# EAGLE design X10_PowerBoard_RevB (EAGLE 9.6.2)
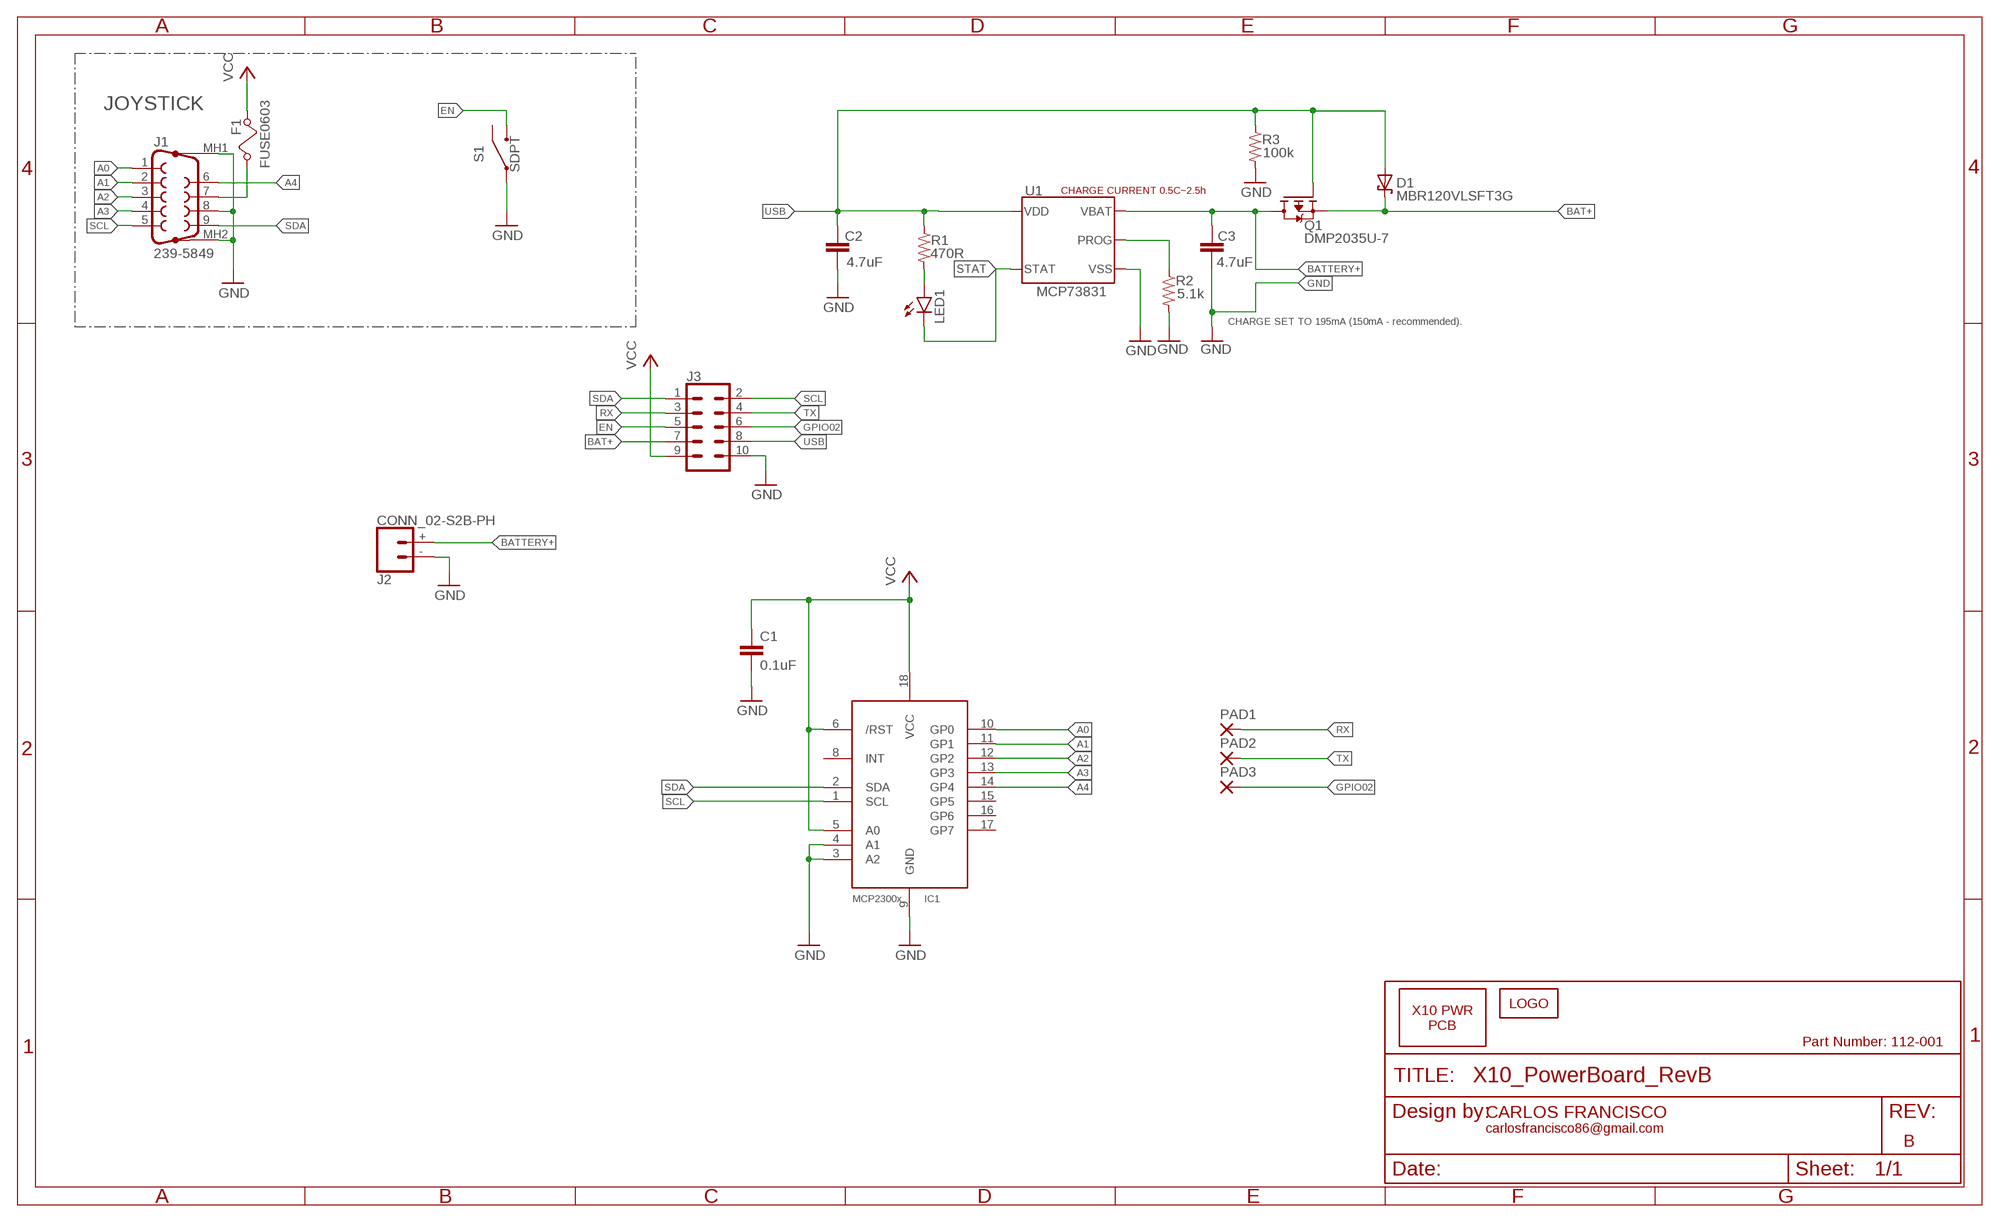
[diagram p0: schematic, sheet 1]

## Parts
C1  0.1uF  C-EUC0603  [C0603]
C2  4.7uF  C-4.7UF-10V-X5R-0603  [CAPC1608X85]
C3  4.7uF  C-4.7UF-10V-X5R-0603  [CAPC1608X85]
D1  MBR120VLSFT3G  DIODE-SCHOTTKY-20V-1ASOD-123FL  [SODFL3616X98N]
F1  FUSE0603  [FUSC1607X75N]
IC1  MCP23008/P  [DIL18]
J1  239-5849  DB9_MALE-SLOTS  [DB9_PLUG_SLOT]
J2  CONN_02-S2B-PH  [S2B-PH-RA]
J3  CONN2_05-HEADER  [2X5_HEADER]
LED1  LEDSML0603  [SML0603]
LOGO1  LOGO-10MM  [LOGO_10MM]
PAD1  1,6/0,8  [1,6/0,8]
PAD2  1,6/0,8  [1,6/0,8]
PAD3  1,6/0,8  [1,6/0,8]
PCB1  X10_PWR_PCB-X10_PWR_PCB  [X10_POWER_PCB]
Q1  DMP2035U-7  P-MOSFET-DMP2035U-7-SOT323  [SOT95P230X110-3N]
R1  470R  R-BACKUP-470R-1%-0603  [RESC1608X60]
R2  5.1k  R-5.1K-1%-0603  [RESC1608X60]
R3  100k  R-100K-1%-0603  [RESC1608X60]
S1  SDPT  SLIDE_SWITCH  [OS102011MA1QN1]
U1  MCP73831  [SOT23-5P95_270X145L35X35N]

## Nets
A0: IC1.10(GP0) J1.1
A1: IC1.11(GP1) J1.2
A2: IC1.12(GP2) J1.3
A3: IC1.13(GP3) J1.4
A4: IC1.14(GP4) J1.6
BAT+: D1.K(C) J3.7 Q1.2(S)
BATTERY+: C3.1 J2.+ Q1.3(D) U1.3(VBAT)
EN: J3.5 S1.1
GND: C1.2 C2.2 C3.2 IC1.3(A2) IC1.4(A1) IC1.9(GND) J1.8 J1.MH1(G1) J1.MH2(G2) J2.- J3.10 R2.1 R3.1 S1.2 U1.2(VSS)
GPIO02: J3.6 PAD3.1(P)
N$1: LED1.A R1.1
N$2: F1.1 J1.7
N$6: R2.2 U1.5(PROG)
RX: J3.3 PAD1.1(P)
SCL: IC1.1(SCL) J1.5 J3.2
SDA: IC1.2(SDA) J1.9 J3.1
STAT: LED1.C U1.1(STAT)
TX: J3.4 PAD2.1(P)
USB: C2.1 D1.A J3.8 Q1.1(G) R1.2 R3.2 U1.4(VDD)
VCC: C1.1 F1.2 IC1.5(A0) IC1.6(/RST) IC1.18(VCC) J3.9
Unconnected: IC1.8(INT) IC1.15(GP5) IC1.16(GP6) IC1.17(GP7) S1.3

## Notes on the sheet
- JOYSTICK
- CHARGE CURRENT 0.5C~2.5h
- CHARGE SET TO 195mA (150mA - recommended).
- Part Number: 112-001
- CARLOS FRANCISCO
- carlosfrancisco86@gmail.com
- B

## Library data of the parts
C1 = rcl:C-EU: CAPACITOR, European symbol; SPICEPREFIX: C
C2 C3 = PacificNovelty:C; DESCRIPTION: CAP CER 4.7UF 10V X5R 0603; MFR: Samsung Electro-Mechanics; MFR_NUM: CL10A475KP8NNNC; OC_FARNELL: unknown; VENDOR: Digi-Key; VENDOR_NUM: 1276-1044-1-ND
D1 = PacificNovelty:DIODE-SCHOTTKY: Schottky Diode; DESCRIPTION: Semiconductor DIODE SCHOTTKY 20V 1A SOD123FL; MFR: On Semiconductor; MFR_NUM: MBR120VLSFT3G; VENDOR: Digi-Key; VENDOR_NUM: MBR120VLSFT3GOSCT-ND
F1 = ACINLibrary:FUSE
IC1 = AceCenter:MCP23008: MCP23008 Inexpensive i2c i/o expander - 8 general purpose i/o pins with optional pullups
J1 = AceCenter:DB9_MALE: D-SUB Connector - Right Angle; DESCRIPTION: D-sub Connector - 2.77mm Pitch; MFR: RS Pro; MFR_NUM: 239-5849; VENDOR: RS-Online; VENDOR_NUM: 239-5849
J2 = AceCenter:CONN_02
J3 = AceCenter:CONN2_05
LED1 = led:LED: LED OSRAM: - CHIPLED LG R971, LG N971, LY N971, LG Q971, LY Q971, LO R971, LY R971 LH N974, LH R974 LS Q976, LO Q976, LY Q976 LO Q996 - Hyper CHIPLED LW Q18S LB Q993, LB Q99A, LB R99A - SideLED LS A670, LO A670, LY A670, LG A670, LP A670 LB A673, LV A673, LT A673, LW A673 LH A674 LY A675 LS A676, LA A676, LO A676, LY A676, LW A676 LS A679, LY A679, LG A679 - Hyper Micro SIDELED® LS Y876, LA Y876, LO Y876, LY Y876 LT Y87S - SmartLED LW L88C, LW L88S LB L89C, LB L89S, LG L890 LS L89K, LO L89K, LY L89K LS L896, LA L896, LO L896, LY L896 - TOPLED LS T670, LO T670, LY T670, LG T670, LP T670 LSG T670, LSP T670, LSY T670, LOP T670, LYG T670 LG T671, LOG T671, LSG T671 LB T673, LV T673, LT T673, LW T673 LH T674 LS T676, LA T676, LO T676, LY T676, LB T676, LH T676, LSB T676, LW T676 LB T67C, LV T67C, LT T67C, LS T67K, LO T67K, LY T67K, LW E67C LS E67B, LA E67B, LO E67B, LY E67B, LB E67C, LV E67C, LT E67C LW T67C LS T679, LY T679, LG T679 LS T770, LO T770, LY T770, LG T770, LP T770 LB T773, LV T773, LT T773, LW T773 LH T774 LS E675, LA E675, LY E675, LS T675 LS T776, LA T776, LO T776, LY T776, LB T776 LHGB T686 LT T68C, LB T68C - Hyper Mini TOPLED® LB M676 - Mini TOPLED Santana® LG M470 LS M47K, LO M47K, LY M47K Source: http://www.osram.convergy.de LUXEON: - LUMILED® LXK2-PW12-R00, LXK2-PW12-S00, LXK2-PW14-U00, LXK2-PW14-V00 LXK2-PM12-R00, LXK2-PM12-S00, LXK2-PM14-U00 LXK2-PE12-Q00, LXK2-PE12-R00, LXK2-PE12-S00, LXK2-PE14-T00, LXK2-PE14-U00 LXK2-PB12-K00, LXK2-PB12-L00, LXK2-PB12-M00, LXK2-PB14-N00, LXK2-PB14-P00, LXK2-PB14-Q00 LXK2-PR12-L00, LXK2-PR12-M00, LXK2-PR14-Q00, LXK2-PR14-R00 LXK2-PD12-Q00, LXK2-PD12-R00, LXK2-PD12-S00 LXK2-PH12-R00, LXK2-PH12-S00 LXK2-PL12-P00, LXK2-PL12-Q00, LXK2-PL12-R00 Source: www.luxeon.com KINGBRIGHT: KA-3528ASYC Source: www.kingbright.com
LOGO1 = AceCenter:LOGO
PAD1-PAD3 = wirepad:1,6/0,8: THROUGH-HOLE PAD
PCB1 = AceCenter:X10_PWR_PCB
Q1 = PacificNovelty:P-MOSFET: P MOSFET; DESCRIPTION: MOSFET P-CH 20V 3.6A SOT-23; MFR: Diodes Incorporated; MFR_NUM: DMP2035U-7; VENDOR: Digi-Key; VENDOR_NUM: DMP2035U-7DICT-ND
R1 = PacificNovelty:R-BACKUP: SMD Resistor; DESCRIPTION: RES SMD 470 OHM 1% 1/10W 0603; MFR: Yageo; MFR_NUM: RC0603FR-07470RL; VENDOR: Digi-Key; VENDOR_NUM: 311-470HRCT-ND
R2 = PacificNovelty:R: SMD Resistor; DESCRIPTION: RES SMD 5.1K OHM 1% 1/10W 0603; MFR: Yageo; MFR_NUM: RC0603FR-075K1L; VENDOR: Digi-Key; VENDOR_NUM: 311-5.10KHRCT-ND
R3 = PacificNovelty:R: SMD Resistor; DESCRIPTION: RES SMD 100K OHM 1% 1/10W 0603; MFR: Yageo; MFR_NUM: RC0603FR-07100KL; VENDOR: Digi-Key; VENDOR_NUM: 311-100KHRCT-ND
S1 = AceCenter:SLIDE_SWITCH: Switch Slide Right Angle SPDT 0.1A 12VDC Through Hole Slide Switch SPDT On-On 0.1 A@ 12 V dc Slide Source: Datasheet <http://www.ckswitches.com/media/1428/os.pdf>; DESCRIPTION: Switch Slide Right Angle SPDT 0.1A 12VDC Through Hole Slide Switch SPDT On-On 0.1 A@ 12 V dc Slide; MFR: C & K COMPONENTS; MFR_NUM: OS102011MA1QN1; VENDOR: RS-ONLINE
U1 = PacificNovelty:MCP73831: MCP73831 - Single-Cell, Fully Integrated Li-Ion,Li-Polymer Charge Management Controllers; DESCRIPTION: Single-Cell, Fully Integrated Li-Ion,Li-Polymer Charge Management Controllers; MFR: Microchip; MFR_NUM: MCP73831T-2ACI/OT; OC_FARNELL: unknown; VENDOR: DigiKey; VENDOR_NUM: MCP73831T-2ACI/OTCT-ND

## Board
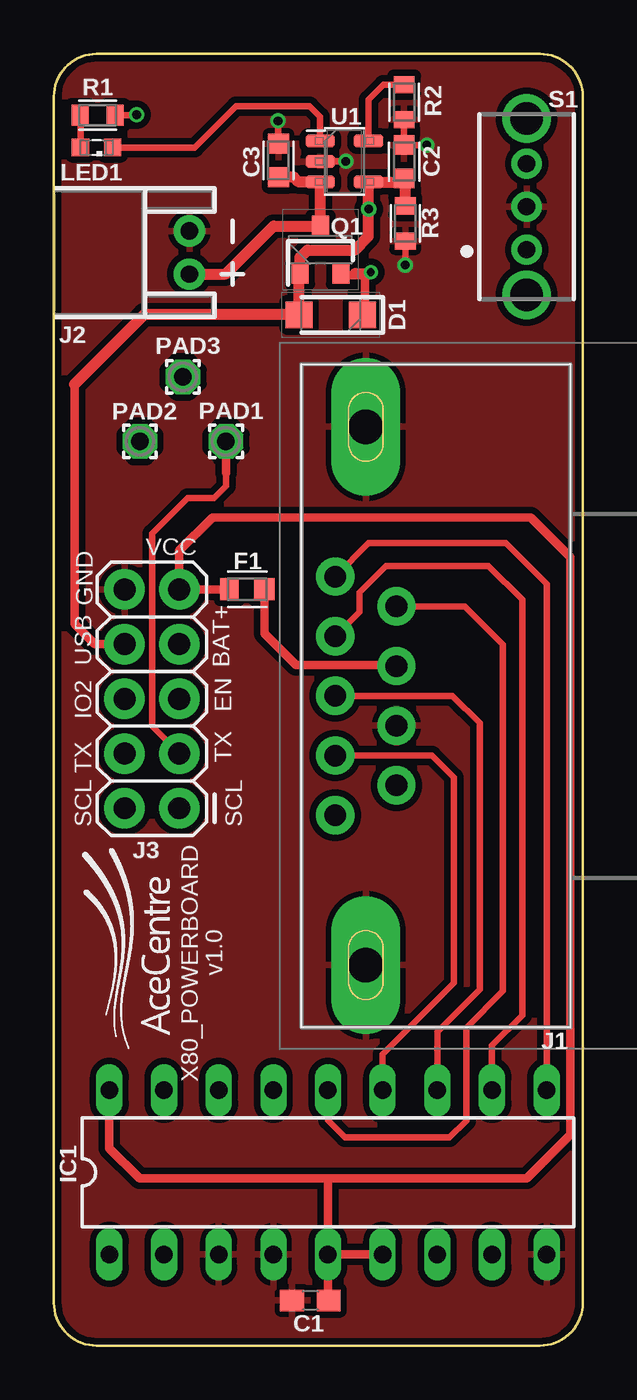
[diagram p1: board, top side]
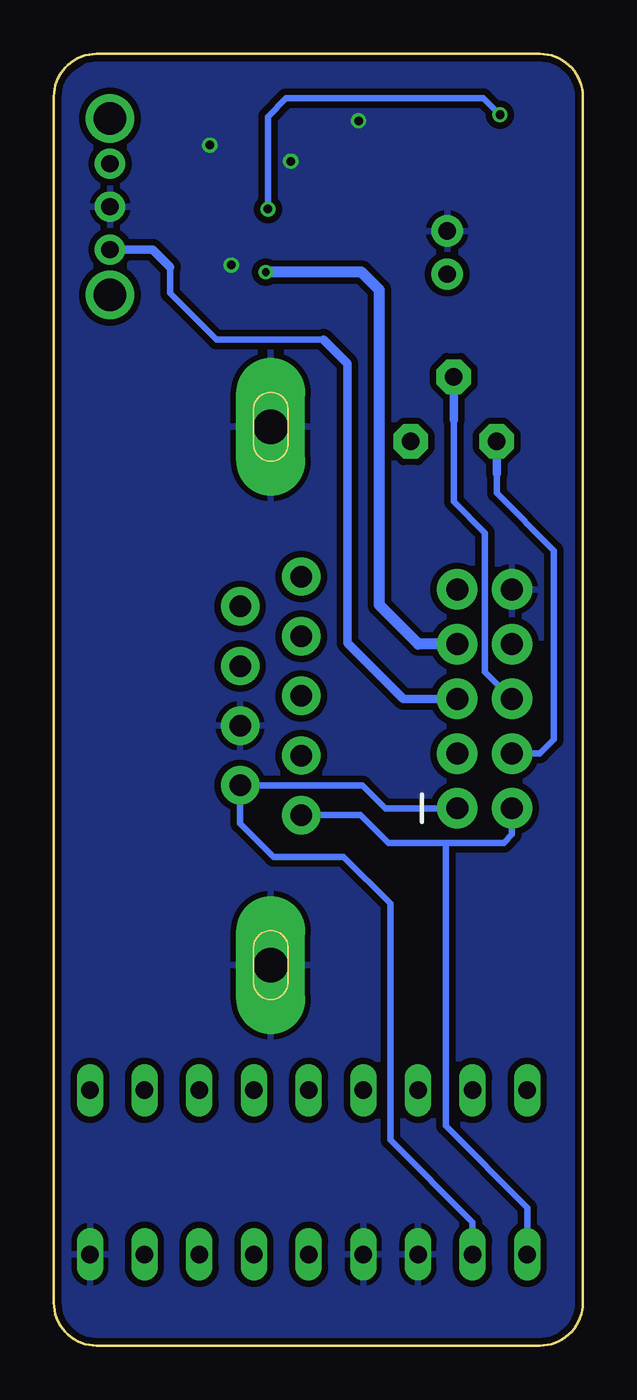
[diagram p2: board, bottom side, seen from below]

Size 24.58 x 60 mm. Coordinates in mm from the lower left corner, seen from the top.
Copper layers (1*16): Top 0.035mm / dielectric 1.5mm / Bottom 0.035mm
Design rules "SparkFun-2-layer-PCBWay-LIMIT": minimum track width 6mil, minimum drill 0.3mm, track to track 6mil, track to pad 6mil, pad to pad 6mil, via to via 6mil, smd to smd 6mil, copper to edge 6mil, drill to drill 6mil, minimum pad ring 6mil, minimum via ring 6mil, stop-mask expansion 4mil, vias tented up to drill 25mil, thermal gap 10mil

### Footprints (pad centres in the part's own frame; a part is rotated, then mirrored left to right if it is on the bottom)
C0603 = smd 1.1 x 1: 1 -0.85,0; 2 0.85,0
CAPC1608X85 = smd 0.921 x 0.97: 1 -0.775,0; 2 0.775,0
SODFL3616X98N = smd 1.25 x 1.22: A 1.475,0; K -1.475,0
FUSC1607X75N = smd 0.935 x 1.011: 1 -0.79,0 | smd 0.854 x 1.011: 2 0.831,0
DIL18 = drill 0.813 long: 1 -10.16,-3.81; 2 -7.62,-3.81; 3 -5.08,-3.81; 4 -2.54,-3.81; 5 0,-3.81; 6 2.54,-3.81; 7 5.08,-3.81; 8 7.62,-3.81; 9 10.16,-3.81; 10 10.16,3.81; 11 7.62,3.81; 12 5.08,3.81; 13 2.54,3.81; 14 0,3.81; 15 -2.54,3.81; 16 -5.08,3.81; 17 -7.62,3.81; 18 -10.16,3.81
DB9_PLUG_SLOT = drill 1 pad 1.778: 1 0,0; 2 -2.77,0; 3 -5.54,0; 4 -8.31,0; 5 -11.08,0; 6 -1.385,-2.84; 7 -4.155,-2.84; 8 -6.925,-2.84; 9 -9.695,-2.84 | drill 1.6 pad 3.2 long: MH1 -18.04,-1.42; MH2 6.96,-1.42
S2B-PH-RA = drill 0.8 pad 1.45: + -1,0; - 1,0
2X5_HEADER = drill 1.016 pad 1.88: 1 0,0; 2 0,2.54; 3 2.54,0; 4 2.54,2.54; 5 5.08,0; 6 5.08,2.54; 7 7.62,0; 8 7.62,2.54; 9 10.16,0; 10 10.16,2.54
SML0603 = smd 0.8 x 0.8: A 0.75,0; C -0.75,0
1,6/0,8 = drill 0.813 pad 1.6 octagon: 1 0,0
SOT95P230X110-3N = smd 0.8 x 0.95: 1 -0.95,-1.1; 2 0.95,-1.1; 3 0,1.1
RESC1608X60 = smd 0.799 x 0.974: 1 -0.815,0; 2 0.815,0
OS102011MA1QN1 = drill 0.8 pad 1.4: 1 -2,0; 2 0,0; 3 2,0 | drill 1.5 pad 2.25: 4 -4.1,0; 5 4.1,0
SOT23-5P95_270X145L35X35N = smd 1.36 x 0.61: 1 -1.12,0.95; 2 -1.12,0; 3 -1.12,-0.95; 4 1.12,-0.95; 5 1.12,0.95

### Placement (x,y rotation side)
C1  11.92,2.1 180 top
C2  16.28,54.99 90 top
C3  10.44,55.05 90 top
D1  12.87,47.88 180 top
F1  8.99,35.14 180 top
IC1  12.74,8.05 0 top
J1  13.08,35.72 90 top
J2  6.3,50.77 90 top
J3  5.83,24.96 90 top
LED1  1.99,55.65 180 top
LOGO1  5.46,13.76 90 top
PAD1  8,42 0 top
PAD2  4,42 0 top
PAD3  6,45 0 top
PCB1  0,0 0 top
Q1  12.39,50.9 0 top
R1  2.04,57.15 0 top
R2  16.28,57.75 90 top
R3  16.33,52.12 90 top
S1  21.97,52.9 90 top
U1  13.5,55 0 top

### Tracks (layer width: path | path; a pad name or v marks a point on that pad's centre or on a via)
A0
  Top 0.3: J1.1 14.63,37.27 21,37.27 22.9,35.37 IC1.10
A1
  Top 0.3: J1.2 14.2,34.07 14.2,34.98 15.44,36.22 20.2,36.22 21.76,34.66 21.76,15.35 20.36,13.95 IC1.11
A2
  Top 0.3: IC1.12 17.82,14.57 19.79,16.54 19.79,28.91 18.52,30.18 J1.3
A3
  Top 0.3: J1.4 17.56,27.41 18.59,26.38 18.59,16.85 15.28,13.54 IC1.13
A4
  Top 0.3: J1.6 19.09,34.34 20.87,32.56 20.87,16.48 19.16,14.77 19.16,10.45 18.39,9.68 13.53,9.68 12.74,10.47 IC1.14
BAT+  (via drill 0.35)
  Top 0.4: v14.73,49.86 14.46,49.59 14.46,47.99 D1.K | Q1.2 13.27,49.73 13.93,49.73 14,49.8
  Top 0.5: 14,49.8 14.67,49.8 v14.73,49.86
  Bottom 0.5: J3.7 7.64,32.58 9.46,34.4 9.46,49.03 10.29,49.86 v14.73,49.86
BATTERY+
  Top 0.5: J2.+ 7.99,49.77 10.22,52 Q1.3 U1.3 11.38,54.05 11.15,54.27 C3.1
EN
  Bottom 0.3: 19.18,50.1 19.18,48.89 17.02,46.73 12.04,46.73
  Bottom 0.4: 12.04,46.73 10.93,45.62 10.93,32.64 8.33,30.04 J3.5 | S1.1 19.98,50.9 19.18,50.1
GND  (via drill 0.4)
  Top 0.3: C3.2 10.42,55.84 v10.42,56.89 | v13.57,55.01 U1.2 | R2.1 C2.2 v17.32,55.77 v17.33,55.76 | R3.1 v16.33,50.19
  pour Top (isolate 0.3): 2.35,60 21,60 arc-90 25,56 25,1 arc-90 24,0 0,0 0,57.65 arc-90
  pour Bottom (isolate 0.3): 0,57.8 0,0 24,0 arc90 25,1 25,56 arc90 21,60 2.2,60 arc90
GPIO02
  Bottom 0.3: 6,43 6,39.2 4.54,37.74 4.54,31.29 J3.6
  Bottom 0.4: PAD3.1 6,43
N$1
  Top 0.3: LED1.A 1.24,57.13 R1.1
N$2
  Top 0.4: J1.7 15.86,31.62 11.26,31.62 9.8,33.09 9.8,35.12 F1.1
N$6
  Top 0.3: U1.5 14.62,57.87 15.31,58.56 R2.2
RX
  Top 0.3: J3.3 4.56,28.77 4.56,37.71 6.21,39.36 7.45,39.36 8.01,39.92 8.01,40.52
  Top 0.4: 8.01,40.52 PAD1.1
SCL
  Bottom 0.3: J1.5 10.32,24.64 9.03,23.35 6.44,23.35 | J3.2 3.29,23.74 3.68,23.35 6.44,23.35 | IC1.1 2.58,6.41 6.37,10.2 6.37,23.28 6.44,23.35
SDA
  Bottom 0.3: J3.1 9.18,24.96 10.24,26.02 J1.9 15.92,24.26 14.37,22.71 11.12,22.71 8.94,20.53 8.94,9.56 5.12,5.74 IC1.2
STAT
  Top 0.3: U1.1 12.38,57.08 11.89,57.57 8.47,57.57 6.55,55.65 LED1.C
TX
  Bottom 0.3: J3.4 2,27.5 1.34,28.16 1.34,36.94 4,39.6 4,40.5
  Bottom 0.4: PAD2.1 4,40.5
USB  (via drill 0.4)
  Top 0.3: R1.2 3.83,57.15 v3.85,57.17 | 14.62,54 U1.4 | 11.39,49.76 Q1.1
  Top 0.4: 0.96,44.65 0.96,33.51 1.89,32.58 J3.8
  Top 0.5: U1.4 16.11,54.05 C2.1 16.33,54.16 R3.2 | 0.96,44.65 4.19,47.88 D1.A 11.39,49.76 | Q1.1 11.44,50.54 11.79,50.89 13.99,50.89 14.62,51.52 v14.62,52.8 | v14.63,52.79 v14.62,52.8 | v14.62,52.8 14.62,54
  Bottom 0.3: v3.85,57.17 4.62,57.94 13.78,57.94 14.63,57.09 v14.63,52.79
VCC
  Top 0.4: C1.1 12.74,2.13 IC1.5 | IC1.5 12.74,7.74 12.71,7.77 | 12.71,7.77 3.98,7.77 2.58,9.17 IC1.18 | IC1.5 IC1.6 | F1.2 8.14,35.12 J3.9 5.83,36.93 7.37,38.47 22.16,38.47 24,36.63 24,9.79 21.98,7.77 12.71,7.77

### Text on the board
tPlace: VCC | GND | USB | BAT+ | IO2 | EN | TX | TX | SCL | SCL | X80_POWERBOARD | v1.0
tDocu: CHANG BATTERY CHARGER TO THIS SIDE.